# Altium schematic sheet esp32.SchDoc
size A4
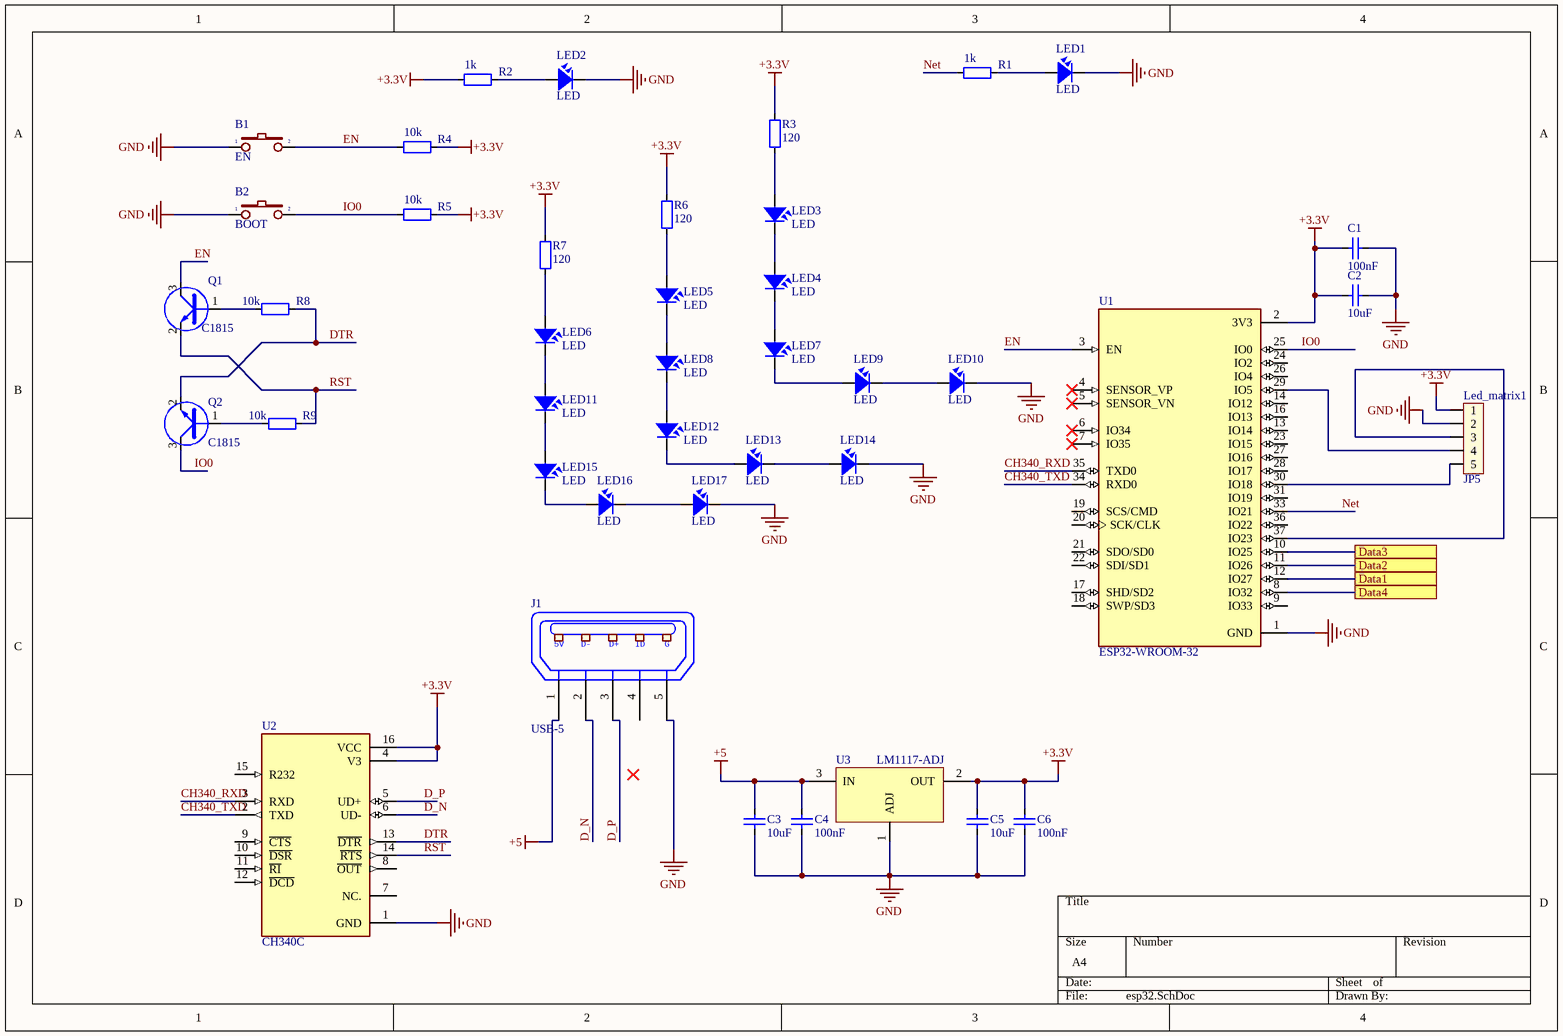
[diagram p0: esp32.SchDoc]

## Parts
B1  EN  [BUTTON_2_SMD]
B2  BOOT  [BUTTON_2_SMD]
C1  100nF  [CAP_0805]
C2  10uF  [CAP_0805]
C3  10uF  [CAP_0805]
C4  100nF  [CAP_0805]
C5  10uF  [CAP_0805]
C6  100nF  [CAP_0805]
J1  USB-5  [USB-M1]
LED1  LED  [LED-0805-Red]
LED2  LED  [LED-0805-Red]
LED3  LED  [LED-0805-Red]
LED4  LED  [LED-0805-Red]
LED5  LED  [LED-0805-Red]
LED6  LED  [LED-0805-Red]
LED7  LED  [LED-0805-Red]
LED8  LED  [LED-0805-Red]
LED9  LED  [LED-0805-Red]
LED10  LED  [LED-0805-Red]
LED11  LED  [LED-0805-Red]
LED12  LED  [LED-0805-Red]
LED13  LED  [LED-0805-Red]
LED14  LED  [LED-0805-Red]
LED15  LED  [LED-0805-Red]
LED16  LED  [LED-0805-Red]
LED17  LED  [LED-0805-Red]
Led_matrix1  JP5  [JP5H]
Q1  C1815  [SOT23]
Q2  C1815  [SOT23]
R1  1k  [RES-SMD-0805]
R2  1k  [RES-SMD-0805]
R3  120  [RES-SMD-0805]
R4  10k  [RES-SMD-0805]
R5  10k  [RES-SMD-0805]
R6  120  [RES-SMD-0805]
R7  120  [RES-SMD-0805]
R8  10k  [RES-SMD-0805]
R9  10k  [RES-SMD-0805]
U1  ESP32-WROOM-32  [ESP32_WROOM32E]
U2  CH340C  [SOIC127P600X180-16N]
U3  LM1117-ADJ  [LM1117-SOP]

## Ports
Data1, Data2, Data3, Data4

## Nets
+3.3V: C1.1 C2.1 C5.1 C6.1 Led_matrix1.1 R2.2 R3.1 R4.1 R5.1 R6.1 R7.1 U1.2(3V3) U2.4(V3) U2.16(VCC) U3.2(OUT)
+5: C3.1 C4.1 J1.1(P1) U3.3(IN)
GND: B1.1 B2.1 C1.2 C2.2 C3.2 C4.2 C5.2 C6.2 J1.5(P5) LED1.2 LED2.2 LED10.2 LED14.2 LED17.2 Led_matrix1.2 U1.1(GND) U2.1(GND) U3.1(ADJ)
CH340_RXD: U1.35(TXD0) U2.3(RXD)
CH340_TXD: U1.34(RXD0) U2.2(TXD)
D_N: J1.2(P2) U2.6(UD-)
D_P: J1.3(P3) U2.5(UD+)
Data1: U1.12(IO27) ; port Data1
Data2: U1.11(IO26) ; port Data2
Data3: U1.10(IO25) ; port Data3
Data4: U1.8(IO32) ; port Data4
DTR: Q2.2(E) R8.1 U2.13(~{DTR})
EN: B1.2 Q1.3(C) R4.2 U1.3(EN)
IO0: B2.2 Q2.3(C) R5.2 U1.25(IO0)
Net: R1.2 U1.33(IO21)
RST: Q1.2(E) R9.1 U2.14(~{RTS})
NetLED1_1: LED1.1 R1.1
NetLED2_1: LED2.1 R2.1
NetLED3_1: LED3.1 R3.2
NetLED3_2: LED3.2 LED4.1
NetLED4_2: LED4.2 LED7.1
NetLED5_1: LED5.1 R6.2
NetLED5_2: LED5.2 LED8.1
NetLED6_1: LED6.1 R7.2
NetLED6_2: LED6.2 LED11.1
NetLED7_2: LED7.2 LED9.1
NetLED8_2: LED8.2 LED12.1
NetLED9_2: LED9.2 LED10.1
NetLED11_2: LED11.2 LED15.1
NetLED12_2: LED12.2 LED13.1
NetLED13_2: LED13.2 LED14.1
NetLED15_2: LED15.2 LED16.1
NetLED16_2: LED16.2 LED17.1
NetLed_matrix1_3: Led_matrix1.3 U1.37(IO23)
NetLed_matrix1_4: Led_matrix1.4 U1.29(IO5)
NetLed_matrix1_5: Led_matrix1.5 U1.30(IO18)
NetQ1_1: Q1.1(B) R8.2
NetQ2_1: Q2.1(B) R9.2

Not connected (* = marked no-connect by the designer): J1 4(P4); U1 4(SENSOR_VP)* 5(SENSOR_VN)* 6(IO34)* 7(IO35)* 9(IO33) 13(IO14) 14(IO12) 16(IO13) 17(SHD/SD2) 18(SWP/SD3) 19(SCS/CMD) 20(SCK/CLK) 21(SDO/SD0) 22(SDI/SD1) 23(IO15) 24(IO2) 26(IO4) 27(IO16) 28(IO17) 31(IO19) 36(IO22); U2 7(NC.) 8(~{OUT}) 9(~{CTS}) 10(~{DSR}) 11(~{RI}) 12(~{DCD}) 15(R232)

## Notes on the sheet
- (in symbol USB-5) 5V; D-; D+; ID; G

## Library data of the parts
B1 B2 = Button 3x4x2.5
C1-C6 = CapSMD: Capacitor; Value: 33p; Published: 8-Jun-2000; LatestRevisionDate: 17-Jul-2002; LatestRevisionNote: Re-released for DXP Platform.; PackageReference: RAD-0.3; Publisher: Altium Limited
J1 = USB-5: Manufacturer: FCI; Manufacturer Part Number: 10118193-0001LF; Connector Type: USB - micro B; Number of Contacts: 5; Gender: Receptacle; Specifications: USB 2.0; .Creator: MM; .Checked PCB: RF; Supplier 1: Digi-Key; RoHS: RoHS Compliant; Category: Connectors, Interconnects; Stock 1: 28642; Pricing 1: 1=0.46, 10=0.433, 25=0.3712, 50=0.3156, 100=0.3032, 250=0.27224, 500=0.25988 (USD); Packaging: Cut Tape (CT); Mounting Type: Surface Mount, Right Angle, Horizontal; Features: Shielded, Solder Retention; Ingress Protection: -; ComponentLink1URL: http://portal.fciconnect.com/Comergent//fci/drawing/10118193.pdf; ComponentLink1Description: http://portal.fciconnect.com/Comergent//fci/drawing/10118193.pdf; Supplier Part Number 1: 609-4616-1-ND; .Checked SCH: MM
LED1-LED17 = LED: LED Single colour Green and Red; Value: LED 3 ly Single Colour
Q1 Q2 = 2SC1815: NPN 600mW, ECB; Value: C1815
R1-R9 = Resistor - SMD: Resistor; Manufacturer: Generic Components; Class: Passive; Published: 08/06/2000; Publisher: Altium Hobart Technology Centre
U1 = ESP32-WROOM-32: Bluetooth, WiFi Transceiver Module 2.4GHz ~ 2.5GHz Surface Mount; MF: Espressif Systems; Package: Module Espressif Systems; Digi-Key_Part_Number: 1904-1010-1-ND; Digi-Key_Purchase_URL: https://www.digikey.com/product-detail/en/espressif-systems/ESP32-WROOM-32/1904-1010-1-ND/8544305?utm_source=snapeda&utm_medium=aggregator&utm_campaign=symbol; Value: *; MP: ESP32-WROOM-32; SnapEDA_Link: https://www.snapeda.com/parts/ESP32-WROOM-32/Espressif%20Systems/view-part/2753322/?ref=snap
U2 = CH340C: USB to serial chip CH340; MF: WCH; Price: None; Availability: Not in stock; MP: CH340C; Package: None; SnapEDA_Link: https://www.snapeda.com/parts/CH340C/WCH/view-part/?ref=snap; Check_prices: https://www.snapeda.com/parts/CH340C/WCH/view-part/?ref=eda; Value: *
U3 = LM1117-ADJ: 800mA Low-Dropout Linear Regulator; Creator: Nguyen Ba Bien; Website: http://group3i.net